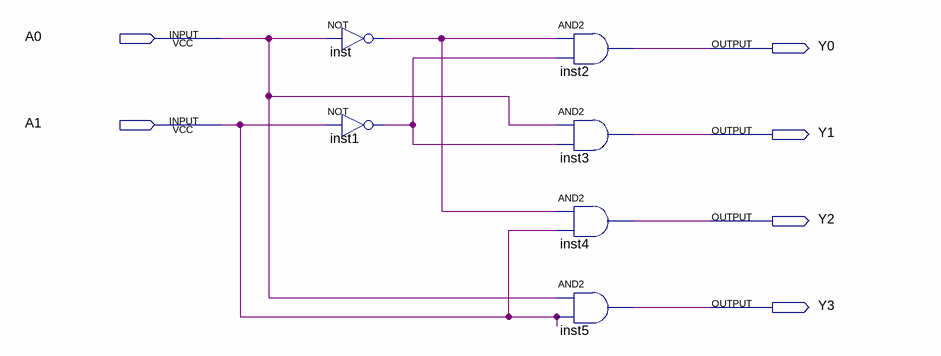
[diagram p0: schematic sheet]
// Quartus schematic decoder.bdf as structural Verilog: 6 symbols, 6 pins
module decoder (
  input  A0,
  input  A1,
  output Y0,
  output Y1,
  output Y2,
  output Y3
);

  wire inst1_out, inst_out;

  not inst (inst_out, A0);
  not inst1 (inst1_out, A1);
  and inst2 (Y0, inst_out, inst1_out);
  and inst3 (Y1, A0, inst1_out);
  and inst4 (Y2, inst_out, A1);
  and inst5 (Y3, A0, A1);
endmodule
